# Altium schematic sheet 02. REVISION HISTORY.SchDoc: REVISION HISTORY
size 513 x 386 mm; Project: PROC154E2(001)_SK_AM69; Issue: 1.0; RevCode: E3; Page Create Date: March  8, 1995; Variant Name: Core Design; Schematic Page Number: 2; Page Number: 2; Page Size: C; Comment: MISTRAL_TITLEBLK_CSIZE_1; Page Count: 62; Schematic Page Count: 62; Name: PROC154E2 001 SK AM69; DsnPath: C:\Users\danie\Downloads\sprr466c\PROC154E3_RP\PROC154E3_SCH.DSN; SchematicName: SCHEMATIC1; PageName: 02. REVISION HISTORY; PageSize: C; TopSchematic: True
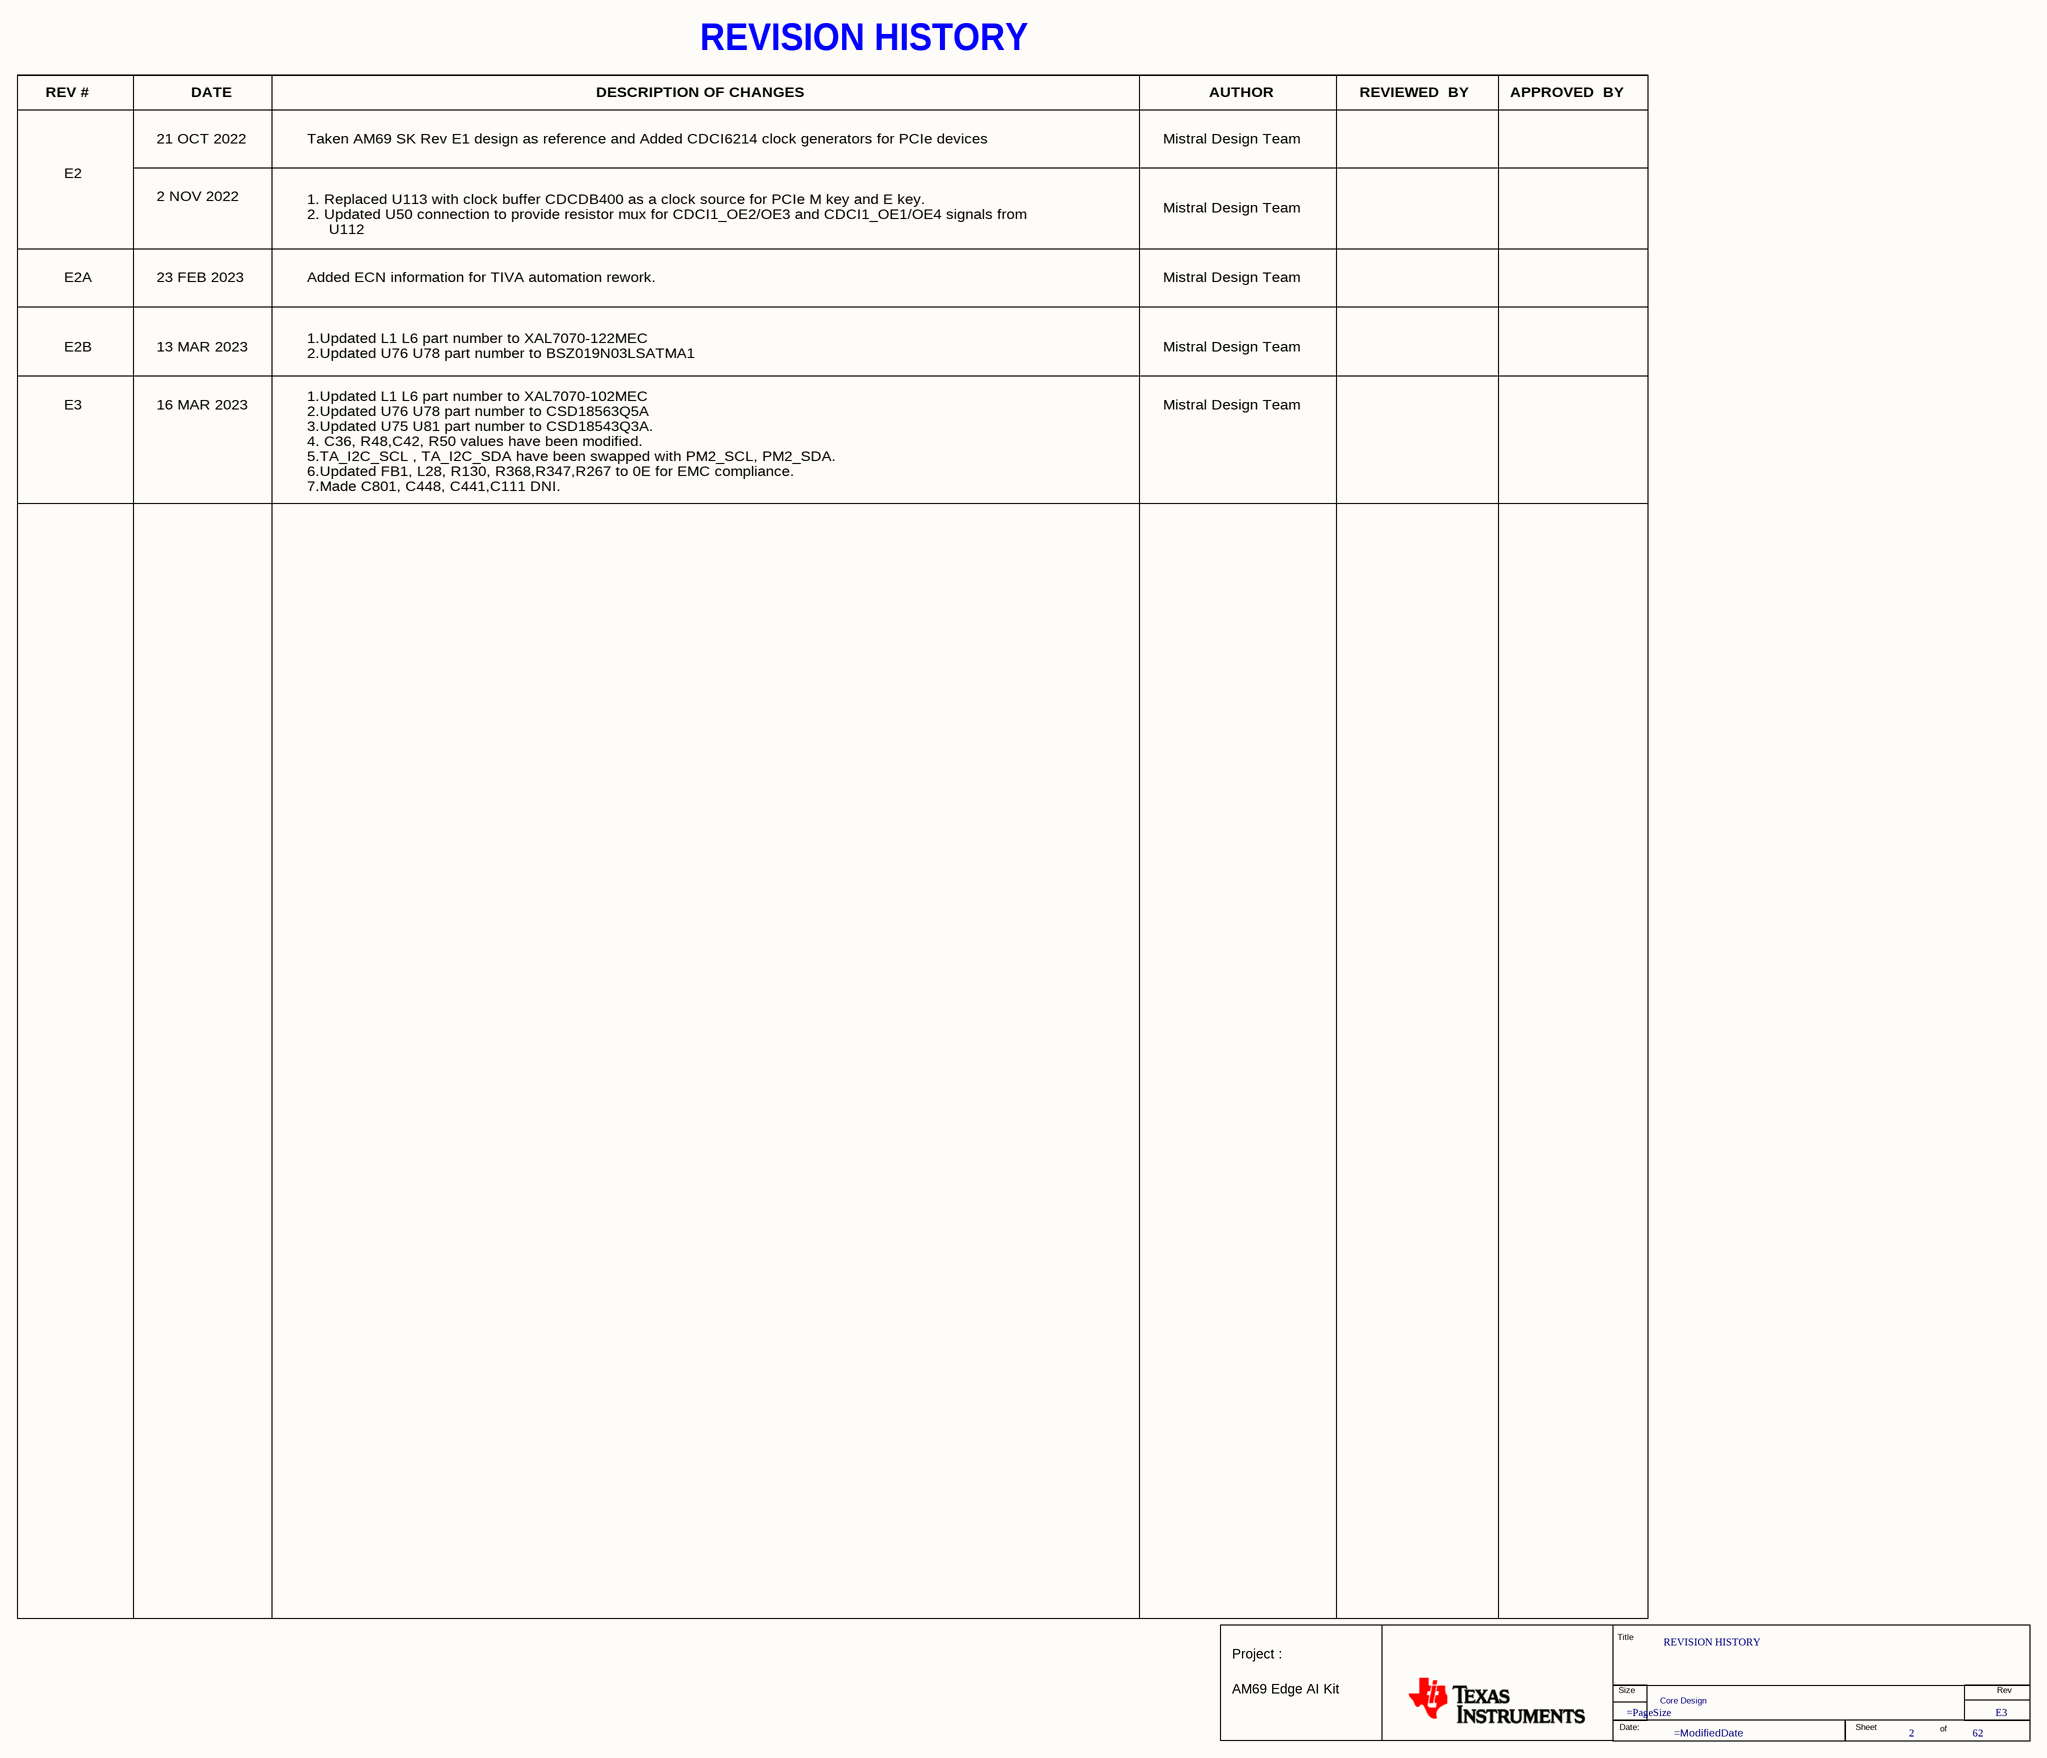
[diagram p0: 02. REVISION HISTORY.SchDoc]

## Parts
*  RevCode: E3  Title: REVISION HISTORY  Page Number: 2  Page Count: 62  Variant Name: Core Design  (hidden comment: MISTRAL_TITLEBLK_CSIZE_1)  (graphical)

## Notes on the sheet
- REV #
- DATE
- DESCRIPTION OF CHANGES
- REVISION HISTORY
- AUTHOR
- REVIEWED  BY
- APPROVED  BY
- 21 OCT 2022
- Taken AM69 SK Rev E1 design as reference and Added CDCI6214 clock generators for PCIe devices
- Mistral Design Team
- E2
- 2 NOV 2022
- 1. Replaced U113 with clock buffer CDCDB400 as a clock source for PCIe M key and E key.
  2. Updated U50 connection to provide resistor mux for CDCI1_OE2/OE3 and CDCI1_OE1/OE4 signals from
  U112
- E2A
- 23 FEB 2023
- Added ECN information for TIVA automation rework.
- 1.Updated L1 L6 part number to XAL7070-122MEC
  2.Updated U76 U78 part number to BSZ019N03LSATMA1
- E2B
- 13 MAR 2023
- 1.Updated L1 L6 part number to XAL7070-102MEC
  2.Updated U76 U78 part number to CSD18563Q5A
  3.Updated U75 U81 part number to CSD18543Q3A.
  4. C36, R48,C42, R50 values have been modified.
  5.TA_I2C_SCL , TA_I2C_SDA have been swapped with PM2_SCL, PM2_SDA.
  6.Updated FB1, L28, R130, R368,R347,R267 to 0E for EMC compliance.
  7.Made C801, C448, C441,C111 DNI.
- E3
- 16 MAR 2023
- (in symbol MISTRAL_TITLEBLK_CSIZE_1) Title; Project :; Size; Rev; AM69 Edge AI Kit; Date:; Sheet; of

## Library data of the parts
* = MISTRAL_TITLEBLK_CSIZE_1: Issue: 1.0; Project: PROC154E2(001)_SK_AM69; Name: PROC154E2 001 SK AM69; Page Create Date: March  8, 1995; Page Size: =PageSize; Page Modify Date: =ModifiedDate; Schematic Page Count: 62; Schematic Page Number: 2